# EAGLE design LiFePo4 Charger Single to Chain -- Finished (EAGLE 6.2)
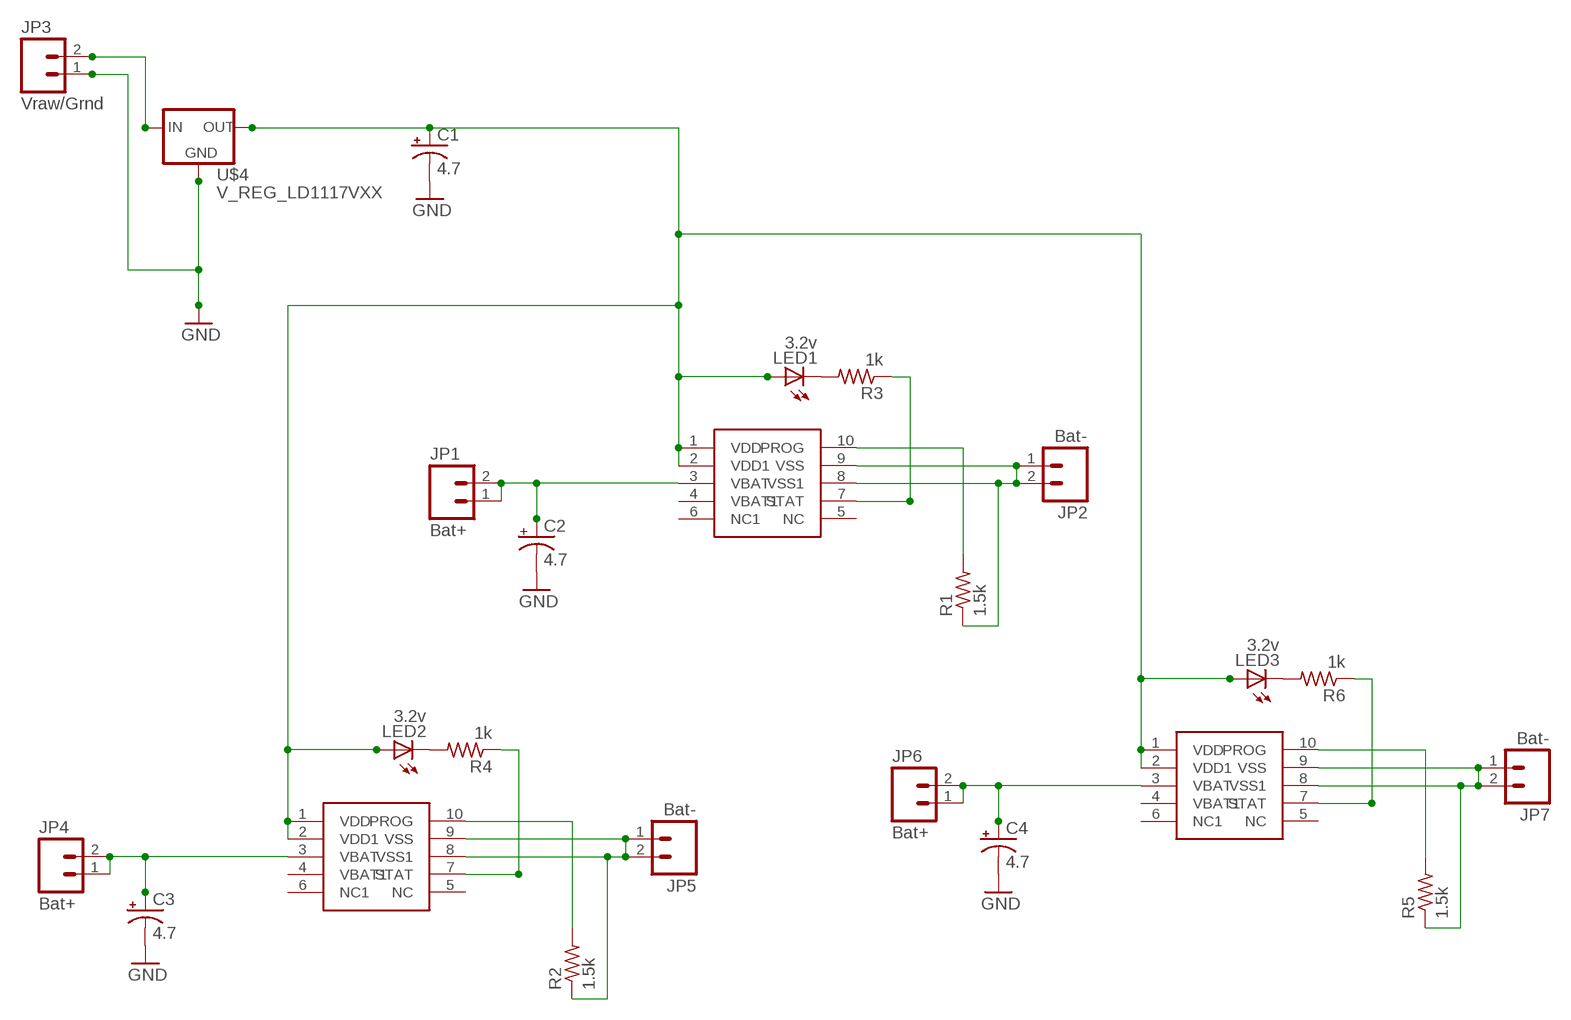
[diagram p0: schematic, sheet 1]

## Parts
C1  4.7  CAP_POLPTH2  [CPOL-RADIAL-10UF-25V]
C2  4.7  CAP_POLPTH2  [CPOL-RADIAL-10UF-25V]
C3  4.7  CAP_POLPTH2  [CPOL-RADIAL-10UF-25V]
C4  4.7  CAP_POLPTH2  [CPOL-RADIAL-10UF-25V]
JP1  Bat+  M02PTH  [1X02]
JP2  Bat-  M02PTH  [1X02]
JP3  Vraw/Grnd  M02PTH  [1X02]
JP4  Bat+  M02PTH  [1X02]
JP5  Bat-  M02PTH  [1X02]
JP6  Bat+  M02PTH  [1X02]
JP7  Bat-  M02PTH  [1X02]
LED1  3.2v  LED3MM  [LED3MM]
LED2  3.2v  LED3MM  [LED3MM]
LED3  3.2v  LED3MM  [LED3MM]
R1  1.5k  R-US_0204/7  [0204/7]
R2  1.5k  R-US_0204/7  [0204/7]
R3  1k  R-US_0204/7  [0204/7]
R4  1k  R-US_0204/7  [0204/7]
R5  1.5k  R-US_0204/7  [0204/7]
R6  1k  R-US_0204/7  [0204/7]
U$1  MCP73123/223  [MCP73123/223]
U$2  MCP73123/223  [MCP73123/223]
U$4  V_REG_LD1117VXX  [78XXL]
U$8  MCP73123/223  [MCP73123/223]

## Nets
GND: C1.2(-) C2.2(-) C3.2(-) C4.2(-) JP3.1 U$4.IN(GND)
N$1: JP3.2 U$4.OUT(IN)
N$3: C2.1(+) JP1.1 JP1.2 U$8.3(VBAT)
N$4: R1.2 U$8.10(PROG)
N$5: JP2.1 JP2.2 R1.1 U$8.8(VSS1) U$8.9(VSS)
N$6: LED1.K(C) R3.2
N$7: R3.1 U$8.7(STAT)
N$8: C3.1(+) JP4.1 JP4.2 U$1.3(VBAT)
N$9: JP5.1 JP5.2 R2.1 U$1.8(VSS1) U$1.9(VSS)
N$10: R4.1 U$1.7(STAT)
N$11: R2.2 U$1.10(PROG)
N$12: C4.1(+) JP6.1 JP6.2 U$2.3(VBAT)
N$13: LED2.K(C) R4.2
N$14: JP7.1 JP7.2 R5.1 U$2.8(VSS1) U$2.9(VSS)
N$15: R6.1 U$2.7(STAT)
N$16: R5.2 U$2.10(PROG)
N$17: LED3.K(C) R6.2
N$18: C1.1(+) LED1.A LED2.A LED3.A U$1.1(VDD) U$1.2(VDD1) U$2.1(VDD) U$2.2(VDD1) U$4.GND(OUT) U$8.1(VDD) U$8.2(VDD1)
Unconnected: U$1.4(VBAT1) U$1.5(NC) U$1.6(NC1) U$2.4(VBAT1) U$2.5(NC) U$2.6(NC1) U$8.4(VBAT1) U$8.5(NC) U$8.6(NC1)

## Library data of the parts
C1-C4 = SparkFun:CAP_POL: Capacitor Polarized These are standard SMD and PTH capacitors. Normally 10uF, 47uF, and 100uF in electrolytic and tantalum varieties. Always verify the external diameter of the through hole cap, it varies with capacity, voltage, and manufacturer. The EIA devices should be standard.
JP1-JP7 = SparkFun:M02: Header 2 Standard 2-pin 0.1" header. Use with straight break away headers (SKU : PRT-00116), right angle break away headers (PRT-00553), swiss pins (PRT-00743), machine pins (PRT-00117), and female headers (PRT-00115). Molex polarized connector foot print use with SKU : PRT-08233 with associated crimp pins and housings.
LED1-LED3 = led:LED: LED OSRAM: - CHIPLED LG R971, LG N971, LY N971, LG Q971, LY Q971, LO R971, LY R971 LH N974, LH R974 LS Q976, LO Q976, LY Q976 LO Q996 - Hyper CHIPLED LW Q18S LB Q993, LB Q99A, LB R99A - SideLED LS A670, LO A670, LY A670, LG A670, LP A670 LB A673, LV A673, LT A673, LW A673 LH A674 LY A675 LS A676, LA A676, LO A676, LY A676, LW A676 LS A679, LY A679, LG A679 - Hyper Micro SIDELED® LS Y876, LA Y876, LO Y876, LY Y876 LT Y87S - SmartLED LW L88C, LW L88S LB L89C, LB L89S, LG L890 LS L89K, LO L89K, LY L89K LS L896, LA L896, LO L896, LY L896 - TOPLED LS T670, LO T670, LY T670, LG T670, LP T670 LSG T670, LSP T670, LSY T670, LOP T670, LYG T670 LG T671, LOG T671, LSG T671 LB T673, LV T673, LT T673, LW T673 LH T674 LS T676, LA T676, LO T676, LY T676, LB T676, LH T676, LSB T676, LW T676 LB T67C, LV T67C, LT T67C, LS T67K, LO T67K, LY T67K, LW E67C LS E67B, LA E67B, LO E67B, LY E67B, LB E67C, LV E67C, LT E67C LW T67C LS T679, LY T679, LG T679 LS T770, LO T770, LY T770, LG T770, LP T770 LB T773, LV T773, LT T773, LW T773 LH T774 LS E675, LA E675, LY E675, LS T675 LS T776, LA T776, LO T776, LY T776, LB T776 LHGB T686 LT T68C, LB T68C - Hyper Mini TOPLED® LB M676 - Mini TOPLED Santana® LG M470 LS M47K, LO M47K, LY M47K Source: http://www.osram.convergy.de LUXEON: - LUMILED® LXK2-PW12-R00, LXK2-PW12-S00, LXK2-PW14-U00, LXK2-PW14-V00 LXK2-PM12-R00, LXK2-PM12-S00, LXK2-PM14-U00 LXK2-PE12-Q00, LXK2-PE12-R00, LXK2-PE12-S00, LXK2-PE14-T00, LXK2-PE14-U00 LXK2-PB12-K00, LXK2-PB12-L00, LXK2-PB12-M00, LXK2-PB14-N00, LXK2-PB14-P00, LXK2-PB14-Q00 LXK2-PR12-L00, LXK2-PR12-M00, LXK2-PR14-Q00, LXK2-PR14-R00 LXK2-PD12-Q00, LXK2-PD12-R00, LXK2-PD12-S00 LXK2-PH12-R00, LXK2-PH12-S00 LXK2-PL12-P00, LXK2-PL12-Q00, LXK2-PL12-R00 Source: www.luxeon.com KINGBRIGHT: KA-3528ASYC Source: www.kingbright.com
R1-R6 = resistor:R-US_: RESISTOR, American symbol
U$1 U$2 U$8 = untitled:MCP73123/223
U$4 = SparkFun:V_REG_LD1117VXX: LD1117VXX voltage regulator. We carry the 3.3V version (COM-00526) in TO-220 package.

## Board
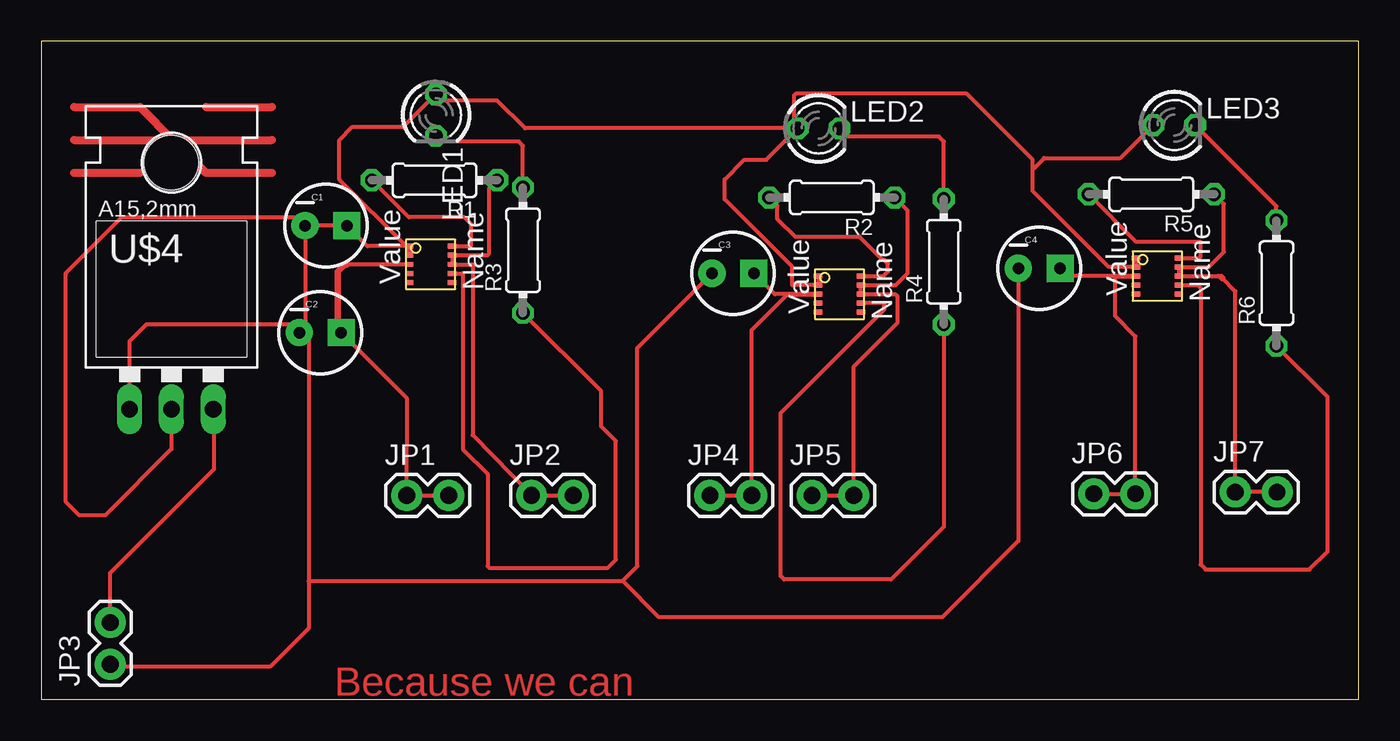
[diagram p1: board, top side]
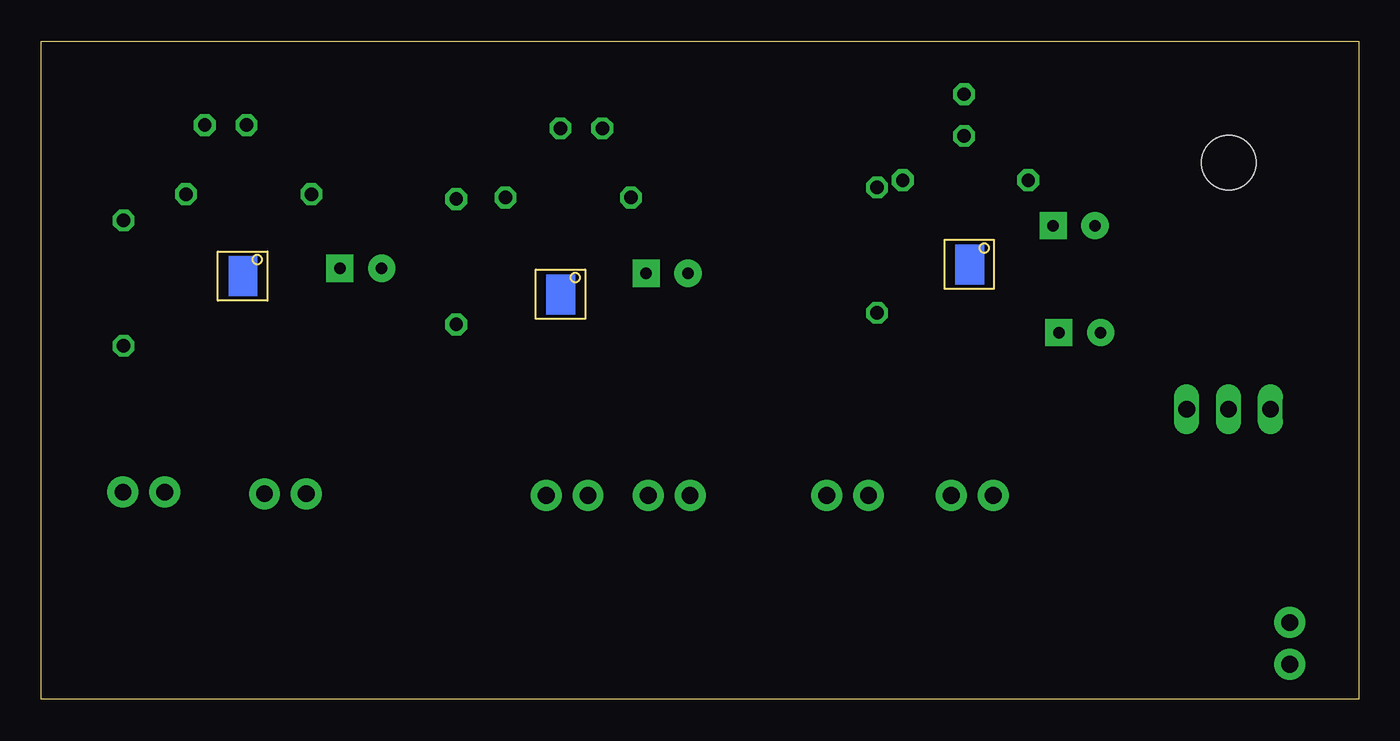
[diagram p2: board, bottom side, seen from below]

Size 80 x 40 mm. Coordinates in mm from the lower left corner, seen from the top.
Outline: 0,0 80,0 80,40 0,40 0,0
Copper layers (1*16): Top 0.035mm / dielectric 1.5mm / Bottom 0.035mm
Design rules: minimum track width 10mil, minimum drill 24mil, track to track 8mil, track to pad 8mil, pad to pad 8mil, via to via 8mil, smd to smd 8mil, copper to edge 40mil, drill to drill 8mil, minimum pad ring 10mil, minimum via ring 8mil, stop-mask expansion 4mil, vias tented up to drill 0mil, thermal gap 10mil

### Footprints (pad centres in the part's own frame; a part is rotated, then mirrored left to right if it is on the bottom)
CPOL-RADIAL-10UF-25V = drill 0.7 pad 1.651 square: 1 1.27,0 | drill 0.7 pad 1.651: 2 -1.27,0
1X02 = drill 1.016 pad 1.88: 1 0,0; 2 2.54,0
LED3MM = drill 0.813 octagon: A -1.27,0; K 1.27,0
0204/7 = drill 0.813 octagon: 1 -3.81,0; 2 3.81,0
MCP73123/223 = smd 0.5 x 0.3: 1 1.47,-1.67; 2 1.47,-2.22; 3 1.47,-2.77; 4 1.47,-3.32; 5 1.47,-3.87; 6 4.07,-3.87; 7 4.07,-3.32; 8 4.07,-2.77; 9 4.07,-2.22; 10 4.07,-1.67
78XXL = drill 1.016 long: GND 0,-3.81; IN -2.54,-3.81; OUT 2.54,-3.81 | hole 3.302: 0,11.176

### Placement (x,y rotation side)
C1  17.29,28.79 0 top
C2  16.94,22.29 0 top
C3  42,25.9 0 top
C4  60.6,26.2 0 top
JP1  22.2,12.4 0 top
JP2  29.77,12.4 0 top
JP3  4.19,2.14 90 top
JP4  40.6,12.4 0 top
JP5  46.8,12.4 0 top
JP6  63.9,12.5 0 top
JP7  72.5,12.6 0 top
LED1  23.97,35.51 270 top
LED2  47.2,34.7 0 top
LED3  68.8,34.9 0 top
R1  23.88,31.55 180 top
R2  48,30.5 180 top
R3  29.25,27.3 90 top
R4  54.8,26.6 90 top
R5  67.4,30.7 180 top
R6  75,25.3 90 top
U$1  45.7,27.4 0 top
U$2  65,28.5 0 top
U$4  7.91,21.45 0 top
U$8  20.88,29.21 0 top

### Tracks (layer width: path | path; a pad name or v marks a point on that pad's centre or on a via)
GND
  Top 0.254: C1.2 16.02,22.64 C2.2 | 16.24,7.2 35.3,7.2 | 16.24,7.2 16.24,22.44 C2.2 | 35.3,7.2 36.2,8.1 36.2,21.37 C3.2 | C4.2 59.33,9.63 54.7,5 37.5,5 35.3,7.2 | 16.24,7.2 16.24,4.34 13.9,2 4.33,2 JP3.1 | U$4.IN 5.37,21.77 6.4,22.8 15.16,22.8 C2.2
N$1
  Top 0.254: JP3.2 4.19,7.69 10.5,14 10.5,17.59 U$4.OUT
N$3
  Top 0.254: JP1.2 JP1.1 22.22,18.28 C2.1 | U$8.3 18.55,26.44
  Top 0.406: 18.55,26.44 arc45 18.37,26.37 18,26 18,22.61 arc45 18.07,22.43 C2.1
N$4
  Top 0.254: U$8.10 26.04,27.54 26.1,27.6 26.1,28.9 25.7,29.3 22.32,29.3 R1.2
N$5
  Top 0.254: JP2.2 JP2.1 26.2,16.07 26.2,26.4 26.16,26.44 U$8.8 U$8.9 27.09,26.99 27.2,27.1 27.2,31.06 R1.1
N$6
  Top 0.254: R3.2 29.25,33.65 29,33.9 24.31,33.9 LED1.K
N$7
  Top 0.254: U$8.7 25.59,25.89 25.6,25.9 25.6,15.2 27.1,13.7 27.1,8.1 27.2,8 34.4,8 34.9,8.5 34.9,15.7 34,16.6 34,18.74 R3.1
N$8
  Top 0.254: JP4.1 JP4.2 43.14,22.44 45.3,24.6 47.14,24.6 U$1.3 44.54,24.63 C3.1
N$9
  Top 0.254: JP5.1 JP5.2 49.34,20.24 52,22.9 52,24.5 51.9,24.6 49.8,24.6 U$1.8 U$1.9 51.88,25.18 52.6,25.9 52.6,29.71 R2.1
N$10
  Top 0.254: R4.1 54.8,10.5 51.6,7.3 45.1,7.3 44.9,7.5 44.9,17.4 51.2,23.7 51.2,24 51.1,24.1 49.79,24.1 U$1.7
N$11
  Top 0.254: U$1.10 51.13,25.73 51.4,26 51.4,26.5 51.2,26.7 51.1,26.7 49.7,28.1 45.8,28.1 44.7,29.2 44.7,29.99 R2.2
N$12
  Top 0.254: JP6.1 JP6.2 66.44,22.06 65.2,23.3 65.2,25.7 66.44,25.7 U$2.3 62.34,25.73 C4.1
N$13
  Top 0.254: R4.2 54.8,33.9 54.5,34.2 48.97,34.2 LED2.K
N$14
  Top 0.254: R5.1 71.8,30.11 71.8,27.2 70.88,26.28 U$2.9 U$2.8 71.47,25.73 arc-45 71.64,25.66 | JP7.2 JP7.1 72.5,24.8 71.7,25.6
  Top 0.406: 71.64,25.66 71.7,25.6
N$15
  Top 0.254: U$2.7 70.22,25.18 70.4,25 70.4,8.2 70.7,7.9 77,7.9 78.1,9 78.1,18.39 R6.1
N$16
  Top 0.254: U$2.10 70.33,26.83 70.4,26.9 70.4,27.8 66.49,27.8 R5.2
N$17
  Top 0.254: R6.2 75,29.97 LED3.K
N$18
  Top 0.254: U$8.2 U$8.1 22.16,27.54 | 22.16,27.54 19.81,27.54 C1.1 16,28.79 | 22.16,27.54 18.1,31.6 18.1,34 18.9,34.8 21.99,34.8 LED1.A 23.86,36.41 27.67,36.41 29.38,34.7 LED2.A | 16,28.79 15.38,28.79 | U$1.1 U$1.2 45.62,25.18 45.6,25.2 45.6,26.3 41.5,30.4 41.5,31.6 42.7,32.8 44.03,32.8 LED2.A | U$2.1 U$2.2 64.82,26.28 60.2,30.9 60.2,32.2 | 60.2,32.2 60.9,32.9 65.53,32.9 LED3.A | 60.2,32.2 60.2,32.8 56.2,36.8 45.8,36.8 45.7,36.7 45.7,34.93 LED2.A | U$4.GND 7.91,15.21 3.9,11.2 2.3,11.2 1.5,12 1.5,25.9 4.9,29.3 15.49,29.3 16,28.79
N$19
  Top 0.5: 2,36 6,36 8,34 | 2,34 8,34 | 8,34 14,34 | 8,34 10,32 14,32
N$20
  Top 0.5: 2,32 6,32
N$21
  Top 0.5: 10,36 14,36

### Text on the board
Top: Because we can